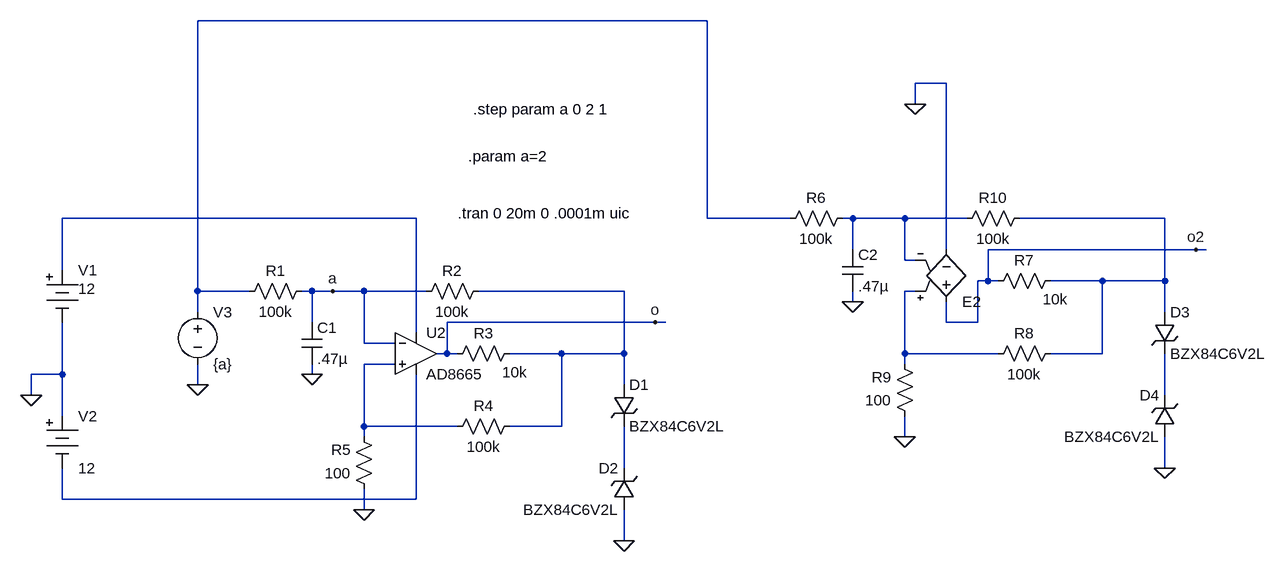
[diagram p0: schematic pwm.asc]
pwm.asc, the LTspice schematic file:
Version 4
SHEET 1 1760 680
WIRE 896 -320 112 -320
WIRE 1264 -224 1216 -224
WIRE 1216 -192 1216 -224
WIRE 448 -16 -96 -16
WIRE 896 -16 896 -320
WIRE 1024 -16 896 -16
WIRE 1120 -16 1104 -16
WIRE 1200 -16 1120 -16
WIRE 1296 -16 1200 -16
WIRE 1600 -16 1376 -16
WIRE 1120 32 1120 -16
WIRE 1264 32 1264 -224
WIRE 1648 32 1328 32
WIRE 1664 32 1648 32
WIRE 1200 48 1200 -16
WIRE 1216 48 1200 48
WIRE -96 64 -96 -16
WIRE 1328 80 1328 32
WIRE 1328 80 1312 80
WIRE 1344 80 1328 80
WIRE 1504 80 1424 80
WIRE 1600 80 1600 -16
WIRE 1600 80 1504 80
WIRE 112 96 112 -320
WIRE 192 96 112 96
WIRE 288 96 272 96
WIRE 320 96 288 96
WIRE 368 96 320 96
WIRE 464 96 368 96
WIRE 768 96 544 96
WIRE 1216 96 1200 96
WIRE 1120 112 1120 96
WIRE 112 128 112 96
WIRE 1600 128 1600 80
WIRE 288 144 288 96
WIRE 816 144 496 144
WIRE 832 144 816 144
WIRE 1264 144 1264 112
WIRE 1312 144 1312 80
WIRE 1312 144 1264 144
WIRE 448 160 448 -16
WIRE 368 176 368 96
WIRE 416 176 368 176
WIRE 496 192 496 144
WIRE 496 192 480 192
WIRE 512 192 496 192
WIRE 672 192 592 192
WIRE 768 192 768 96
WIRE 768 192 672 192
WIRE 1200 192 1200 96
WIRE 1344 192 1200 192
WIRE 1504 192 1504 80
WIRE 1504 192 1424 192
WIRE 416 208 368 208
WIRE 1200 208 1200 192
WIRE -96 224 -96 144
WIRE -96 224 -144 224
WIRE 288 224 288 208
WIRE 112 240 112 208
WIRE 768 240 768 192
WIRE -144 256 -144 224
WIRE 1600 256 1600 192
WIRE -96 288 -96 224
WIRE 368 304 368 208
WIRE 512 304 368 304
WIRE 672 304 672 192
WIRE 672 304 592 304
WIRE 368 320 368 304
WIRE 1200 320 1200 288
WIRE 768 368 768 304
WIRE 1600 368 1600 320
WIRE -96 416 -96 368
WIRE 448 416 448 224
WIRE 448 416 -96 416
WIRE 368 432 368 400
WIRE 768 480 768 432
FLAG -144 256 0
FLAG 768 480 0
FLAG 288 224 0
FLAG 368 432 0
FLAG 112 240 0
FLAG 816 144 o
FLAG 320 96 a
FLAG 1600 368 0
FLAG 1120 112 0
FLAG 1200 320 0
FLAG 1648 32 o2
FLAG 1216 -192 0
SYMBOL Misc\\battery -96 48 R0
WINDOW 3 24 44 Left 2
WINDOW 123 0 0 Left 2
WINDOW 39 0 0 Left 2
SYMATTR Value 12
SYMATTR InstName V1
SYMBOL Misc\\battery -96 272 R0
WINDOW 123 0 0 Left 2
WINDOW 39 0 0 Left 2
SYMATTR InstName V2
SYMATTR Value 12
SYMBOL zener 752 240 R0
SYMATTR InstName D1
SYMATTR Value BZX84C6V2L
SYMBOL zener 784 432 R180
WINDOW 0 24 64 Left 2
WINDOW 3 24 0 Left 2
SYMATTR InstName D2
SYMATTR Value BZX84C6V2L
SYMBOL res 288 80 R90
WINDOW 0 0 56 VBottom 2
WINDOW 3 32 56 VTop 2
SYMATTR InstName R1
SYMATTR Value 100k
SYMBOL res 608 176 R90
WINDOW 0 0 56 VBottom 2
WINDOW 3 29 8 VTop 2
SYMATTR InstName R3
SYMATTR Value 10k
SYMBOL res 608 288 R90
WINDOW 0 0 56 VBottom 2
WINDOW 3 32 56 VTop 2
SYMATTR InstName R4
SYMATTR Value 100k
SYMBOL res 384 416 R180
WINDOW 0 36 76 Left 2
WINDOW 3 36 40 Left 2
SYMATTR InstName R5
SYMATTR Value 100
SYMBOL cap 272 144 R0
SYMATTR InstName C1
SYMATTR Value .47µ
SYMBOL res 560 80 R90
WINDOW 0 0 56 VBottom 2
WINDOW 3 32 56 VTop 2
SYMATTR InstName R2
SYMATTR Value 100k
SYMBOL voltage 112 112 R0
WINDOW 123 0 0 Left 0
WINDOW 39 0 0 Left 0
SYMATTR InstName V3
SYMATTR Value {a}
SYMBOL OpAmps\\AD8665 448 128 R0
SYMATTR InstName U2
SYMBOL zener 1584 128 R0
SYMATTR InstName D3
SYMATTR Value BZX84C6V2L
SYMBOL zener 1616 320 R180
WINDOW 0 24 64 Left 2
WINDOW 3 24 0 Left 2
SYMATTR InstName D4
SYMATTR Value BZX84C6V2L
SYMBOL res 1120 -32 R90
WINDOW 0 0 56 VBottom 2
WINDOW 3 32 56 VTop 2
SYMATTR InstName R6
SYMATTR Value 100k
SYMBOL res 1440 64 R90
WINDOW 0 0 56 VBottom 2
WINDOW 3 29 8 VTop 2
SYMATTR InstName R7
SYMATTR Value 10k
SYMBOL res 1440 176 R90
WINDOW 0 0 56 VBottom 2
WINDOW 3 32 56 VTop 2
SYMATTR InstName R8
SYMATTR Value 100k
SYMBOL res 1216 304 R180
WINDOW 0 36 76 Left 2
WINDOW 3 36 40 Left 2
SYMATTR InstName R9
SYMATTR Value 100
SYMBOL cap 1104 32 R0
SYMATTR InstName C2
SYMATTR Value .47µ
SYMBOL res 1392 -32 R90
WINDOW 0 0 56 VBottom 2
WINDOW 3 32 56 VTop 2
SYMATTR InstName R10
SYMATTR Value 100k
SYMBOL e 1264 128 M180
WINDOW 3 24 96 Invisible 2
SYMATTR Value (-100,-12)(-1u,-12)(1u,12)(100,12)
SYMATTR InstName E2
SYMATTR SpiceModel table
TEXT 512 -24 Left 2 !.tran 0 20m 0 .0001m uic
TEXT 528 -112 Left 2 !.param a=2
TEXT 536 -184 Left 2 !.step param a 0 2 1

The netlist it stands for:
* pwm.asc
V1 N002 0 12
V2 0 N010 12
D1 N005 N009 BZX84C6V2L
D2 0 N009 BZX84C6V2L
R1 a N001 100k
R3 N005 o 10k
R4 N005 N007 100k
R5 0 N007 100
C1 a 0 .47µ
R2 N005 a 100k
V3 N001 0 {a}
XU2 N007 a N002 N010 o AD8665  ; pins In+ In- V+ V- OUT
D3 N004 N008 BZX84C6V2L
D4 0 N008 BZX84C6V2L
R6 N003 N001 100k
R7 N004 o2 10k
R8 N004 N006 100k
R9 0 N006 100
C2 N003 0 .47µ
R10 N004 N003 100k
E2 o2 0 N006 N003 table (-100,-12)(-1u,-12)(1u,12)(100,12)
.model D D
.lib standard.dio
.tran 0 20m 0 .0001m uic
.param a=2
.step param a 0 2 1
.backanno
.end